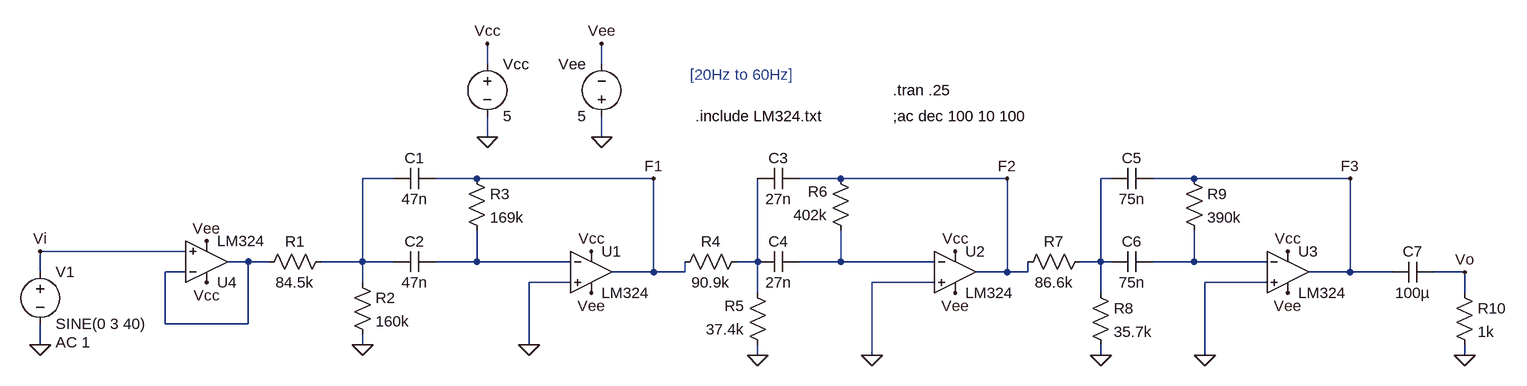
[diagram p0: schematic FinalSubBassFilterBUF.asc]
FinalSubBassFilterBUF.asc, the LTspice schematic file:
Version 4
SHEET 1 1552 680
WIRE -64 -160 -64 -192
WIRE 112 -160 112 -192
WIRE -64 -48 -64 -80
WIRE 112 -48 112 -80
WIRE -208 16 -256 16
WIRE -80 16 -144 16
WIRE 192 16 -80 16
WIRE 480 16 416 16
WIRE 736 16 480 16
WIRE 896 16 880 16
WIRE 1024 16 960 16
WIRE 1264 16 1024 16
WIRE -528 128 -752 128
WIRE -432 144 -464 144
WIRE -400 144 -432 144
WIRE -256 144 -256 16
WIRE -256 144 -320 144
WIRE -208 144 -256 144
WIRE -80 144 -80 96
WIRE -80 144 -144 144
WIRE 64 144 -80 144
WIRE 352 144 352 16
WIRE 352 144 320 144
WIRE 480 144 480 96
WIRE 480 144 416 144
WIRE 624 144 480 144
WIRE 880 144 880 16
WIRE 880 144 848 144
WIRE 896 144 880 144
WIRE 1024 144 1024 96
WIRE 1024 144 960 144
WIRE 1136 144 1024 144
WIRE -752 160 -752 128
WIRE -528 160 -560 160
WIRE 192 160 192 16
WIRE 192 160 128 160
WIRE 240 160 240 144
WIRE 240 160 192 160
WIRE 736 160 736 16
WIRE 736 160 688 160
WIRE 768 160 768 144
WIRE 768 160 736 160
WIRE 1264 160 1264 16
WIRE 1264 160 1200 160
WIRE 1328 160 1264 160
WIRE 1440 160 1392 160
WIRE -256 176 -256 144
WIRE 64 176 0 176
WIRE 624 176 528 176
WIRE 1136 176 1040 176
WIRE 352 192 352 144
WIRE 880 192 880 144
WIRE 1440 192 1440 160
WIRE -560 240 -560 160
WIRE -432 240 -432 144
WIRE -432 240 -560 240
WIRE -752 272 -752 240
WIRE -256 272 -256 256
WIRE 0 272 0 176
WIRE 352 288 352 272
WIRE 528 288 528 176
WIRE 880 288 880 272
WIRE 1040 288 1040 176
WIRE 1440 288 1440 272
FLAG 528 288 0
FLAG -752 272 0
FLAG 192 16 F1
FLAG 736 16 F2
FLAG -752 128 Vi
FLAG 1040 288 0
FLAG 1264 16 F3
FLAG 880 288 0
FLAG 352 288 0
FLAG -256 272 0
FLAG 0 272 0
FLAG 96 192 Vee
FLAG 96 128 Vcc
FLAG 656 192 Vee
FLAG 656 128 Vcc
FLAG 1168 192 Vee
FLAG 1168 128 Vcc
FLAG -64 -192 Vcc
FLAG -64 -48 0
FLAG 112 -48 0
FLAG 112 -192 Vee
FLAG 1440 288 0
FLAG 1440 160 Vo
FLAG -496 112 Vee
FLAG -496 176 Vcc
SYMBOL res -304 128 R90
WINDOW 0 0 56 VBottom 2
WINDOW 3 32 56 VTop 2
SYMATTR InstName R1
SYMATTR Value 84.5k
SYMBOL voltage -752 144 R0
WINDOW 123 24 124 Left 2
WINDOW 39 0 0 Left 0
SYMATTR Value2 AC 1
SYMATTR InstName V1
SYMATTR Value SINE(0 3 40)
SYMBOL res -272 160 R0
SYMATTR InstName R2
SYMATTR Value 160k
SYMBOL res -96 0 R0
SYMATTR InstName R3
SYMATTR Value 169k
SYMBOL res 336 128 R90
WINDOW 0 0 56 VBottom 2
WINDOW 3 32 56 VTop 2
SYMATTR InstName R4
SYMATTR Value 90.9k
SYMBOL res 368 288 R180
WINDOW 0 36 76 Left 2
WINDOW 3 36 40 Left 2
SYMATTR InstName R5
SYMATTR Value 37.4k
SYMBOL res 496 112 R180
WINDOW 0 36 76 Left 2
WINDOW 3 36 40 Left 2
SYMATTR InstName R6
SYMATTR Value 402k
SYMBOL res 752 160 R270
WINDOW 0 32 56 VTop 2
WINDOW 3 0 56 VBottom 2
SYMATTR InstName R7
SYMATTR Value 86.6k
SYMBOL res 864 176 R0
SYMATTR InstName R8
SYMATTR Value 35.7k
SYMBOL res 1008 0 R0
SYMATTR InstName R9
SYMATTR Value 390k
SYMBOL cap -144 0 R90
WINDOW 0 0 32 VBottom 2
WINDOW 3 32 32 VTop 2
SYMATTR InstName C1
SYMATTR Value 47n
SYMBOL cap -144 128 R90
WINDOW 0 0 32 VBottom 2
WINDOW 3 32 32 VTop 2
SYMATTR InstName C2
SYMATTR Value 47n
SYMBOL cap 416 0 R90
WINDOW 0 0 32 VBottom 2
WINDOW 3 32 32 VTop 2
SYMATTR InstName C3
SYMATTR Value 27n
SYMBOL cap 416 128 R90
WINDOW 0 0 32 VBottom 2
WINDOW 3 32 32 VTop 2
SYMATTR InstName C4
SYMATTR Value 27n
SYMBOL cap 960 0 R90
WINDOW 0 0 32 VBottom 2
WINDOW 3 32 32 VTop 2
SYMATTR InstName C5
SYMATTR Value 75n
SYMBOL cap 960 128 R90
WINDOW 0 0 32 VBottom 2
WINDOW 3 32 32 VTop 2
SYMATTR InstName C6
SYMATTR Value 75n
SYMBOL OpAmps\\opamp2 96 96 R0
SYMATTR InstName U1
SYMATTR Value LM324
SYMBOL OpAmps\\opamp2 656 96 R0
SYMATTR InstName U2
SYMATTR Value LM324
SYMBOL OpAmps\\opamp2 1168 96 R0
SYMATTR InstName U3
SYMATTR Value LM324
SYMBOL voltage -64 -176 R0
WINDOW 123 0 0 Left 0
WINDOW 39 0 0 Left 0
SYMATTR InstName Vcc
SYMATTR Value 5
SYMBOL voltage 112 -64 R180
WINDOW 0 24 96 Left 2
WINDOW 3 24 16 Left 2
WINDOW 123 0 0 Left 0
WINDOW 39 0 0 Left 0
SYMATTR InstName Vee
SYMATTR Value 5
SYMBOL cap 1392 144 R90
WINDOW 0 0 32 VBottom 2
WINDOW 3 32 32 VTop 2
SYMATTR InstName C7
SYMATTR Value 100µ
SYMBOL res 1424 176 R0
SYMATTR InstName R10
SYMATTR Value 1k
SYMBOL OpAmps\\opamp2 -496 208 M180
SYMATTR InstName U4
SYMATTR Value LM324
TEXT 560 -120 Left 2 !.tran .25
TEXT 560 -80 Left 2 !;ac dec 100 10 100
TEXT 248 -144 Left 2 ;[20Hz to 60Hz]
TEXT 256 -80 Left 2 !.include LM324.txt

The netlist it stands for:
* FinalSubBassFilterBUF.asc
R1 N001 N003 84.5k
V1 Vi 0 SINE(0 3 40) AC 1
R2 N001 0 160k
R3 F1 N004 169k
R4 N005 F1 90.9k
R5 0 N005 37.4k
R6 N006 F2 402k
R7 F2 N002 86.6k
R8 N002 0 35.7k
R9 F3 N007 390k
C1 F1 N001 47n
C2 N004 N001 47n
C3 F2 N005 27n
C4 N006 N005 27n
C5 F3 N002 75n
C6 N007 N002 75n
XU1 0 N004 Vcc Vee F1 LM324  ; pins In+ In- V+ V- OUT
XU2 0 N006 Vcc Vee F2 LM324  ; pins In+ In- V+ V- OUT
XU3 0 N007 Vcc Vee F3 LM324  ; pins In+ In- V+ V- OUT
Vcc Vcc 0 5
Vee 0 Vee 5
C7 Vo F3 100µ
R10 Vo 0 1k
XU4 Vi N003 Vcc Vee N003 LM324  ; pins In+ In- V+ V- OUT
.tran .25
;ac dec 100 10 100
* [20Hz to 60Hz]
.include LM324.txt
.backanno
.end